# EAGLE design Shield (EAGLE 8.0.2)
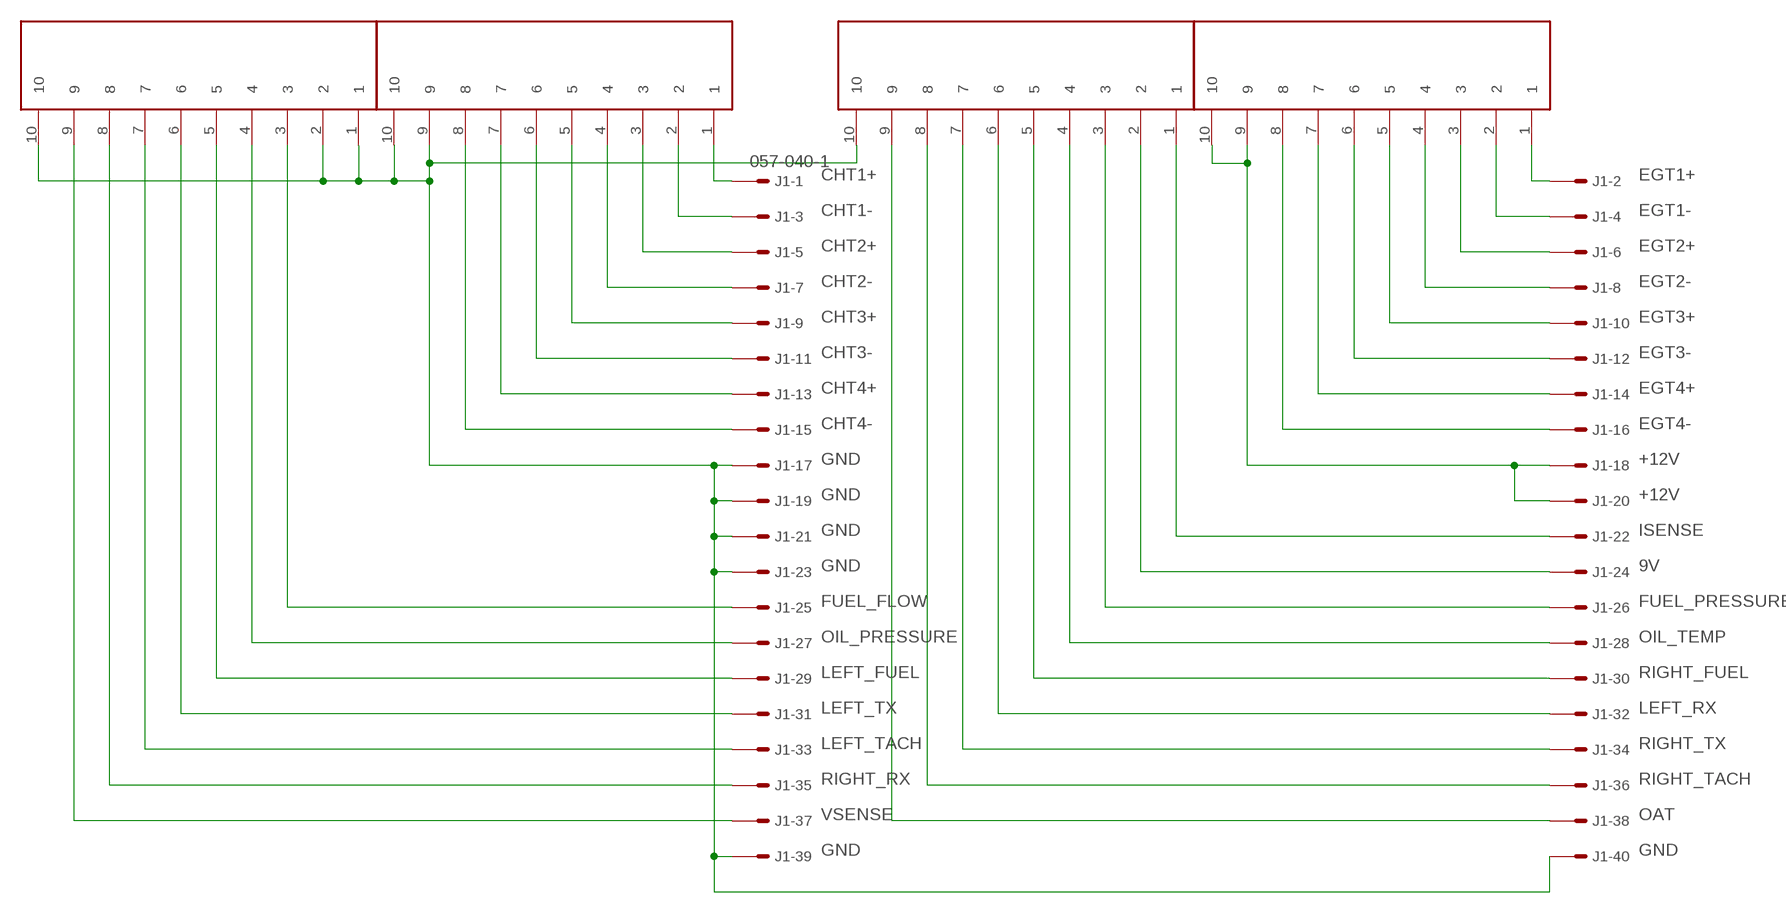
[diagram p0: schematic, sheet 1]

## Parts
J1  057-040-1  [057-040-1]
TB1  282847-10  [282847-10]
TB2  282847-10  [282847-10]
TB3  282847-10  [282847-10]
TB4  282847-10  [282847-10]

## Nets
9V: J1.24 TB3.2
+12V: J1.18 J1.20 TB4.9 TB4.10
CHT1+: J1.1 TB2.1
CHT1-: J1.3 TB2.2
CHT2+: J1.5 TB2.3
CHT2-: J1.7 TB2.4
CHT3+: J1.9 TB2.5
CHT3-: J1.11 TB2.6
CHT4+: J1.13 TB2.7
CHT4-: J1.15 TB2.8
EGT1+: J1.2 TB4.1
EGT1-: J1.4 TB4.2
EGT2+: J1.6 TB4.3
EGT2-: J1.8 TB4.4
EGT3+: J1.10 TB4.5
EGT3-: J1.12 TB4.6
EGT4+: J1.14 TB4.7
EGT4-: J1.16 TB4.8
FUEL_FLOW: J1.25 TB1.3
FUEL_PRESSURE: J1.26 TB3.3
GND: J1.17 J1.19 J1.21 J1.23 J1.39 J1.40 TB1.1 TB1.2 TB1.10 TB2.9 TB2.10 TB3.10
ISENSE: J1.22 TB3.1
LEFT_FUEL: J1.29 TB1.5
LEFT_RX: J1.32 TB3.6
LEFT_TACH: J1.33 TB1.7
LEFT_TX: J1.31 TB1.6
OAT: J1.38 TB3.9
OIL_PRESSURE: J1.27 TB1.4
OIL_TEMP: J1.28 TB3.4
RIGHT_FUEL: J1.30 TB3.5
RIGHT_RX: J1.35 TB1.8
RIGHT_TACH: J1.36 TB3.8
RIGHT_TX: J1.34 TB3.7
VSENSE: J1.37 TB1.9

## Library data of the parts
J1 = con-panduit-changed:057-040-: CONNECTOR 40-pin series 057 contact pc board low profile headers; OC_FARNELL: unknown; OC_NEWARK: unknown; PARTNO: SBH11-PBPC-D20-ST-BK
TB1-TB4 = TEConnectivity:282847-10; PARTNO: 1-282847-0

## Board
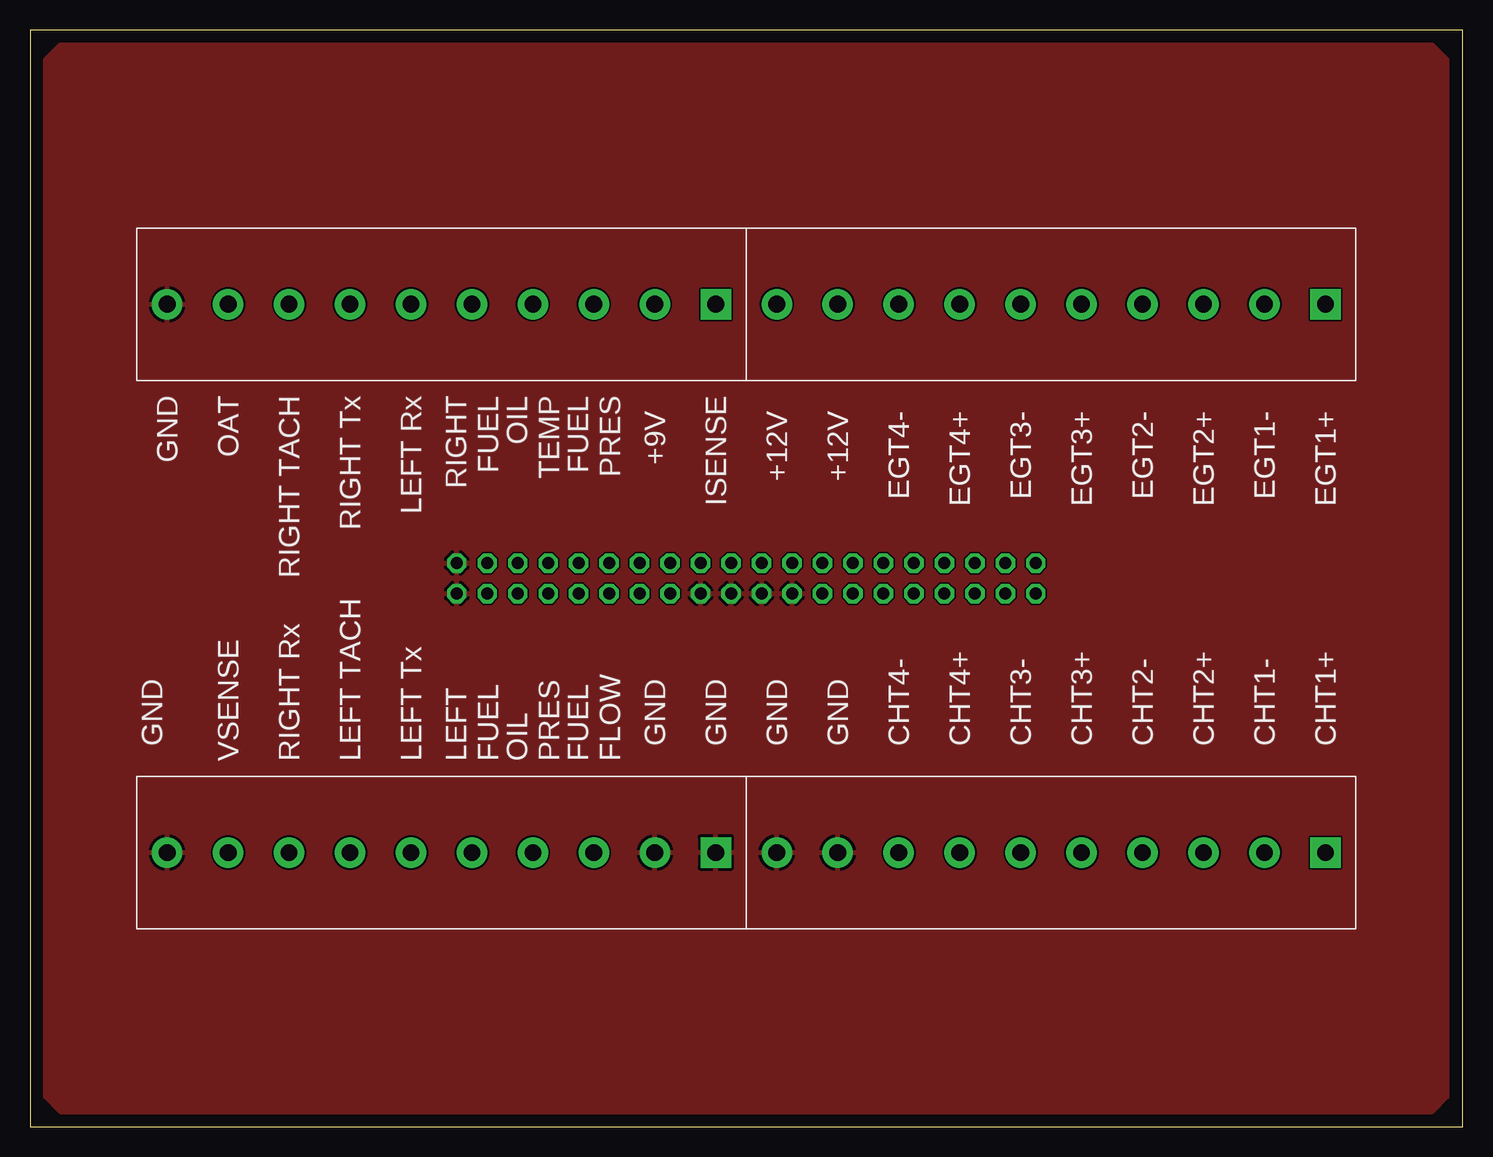
[diagram p1: board, top side]
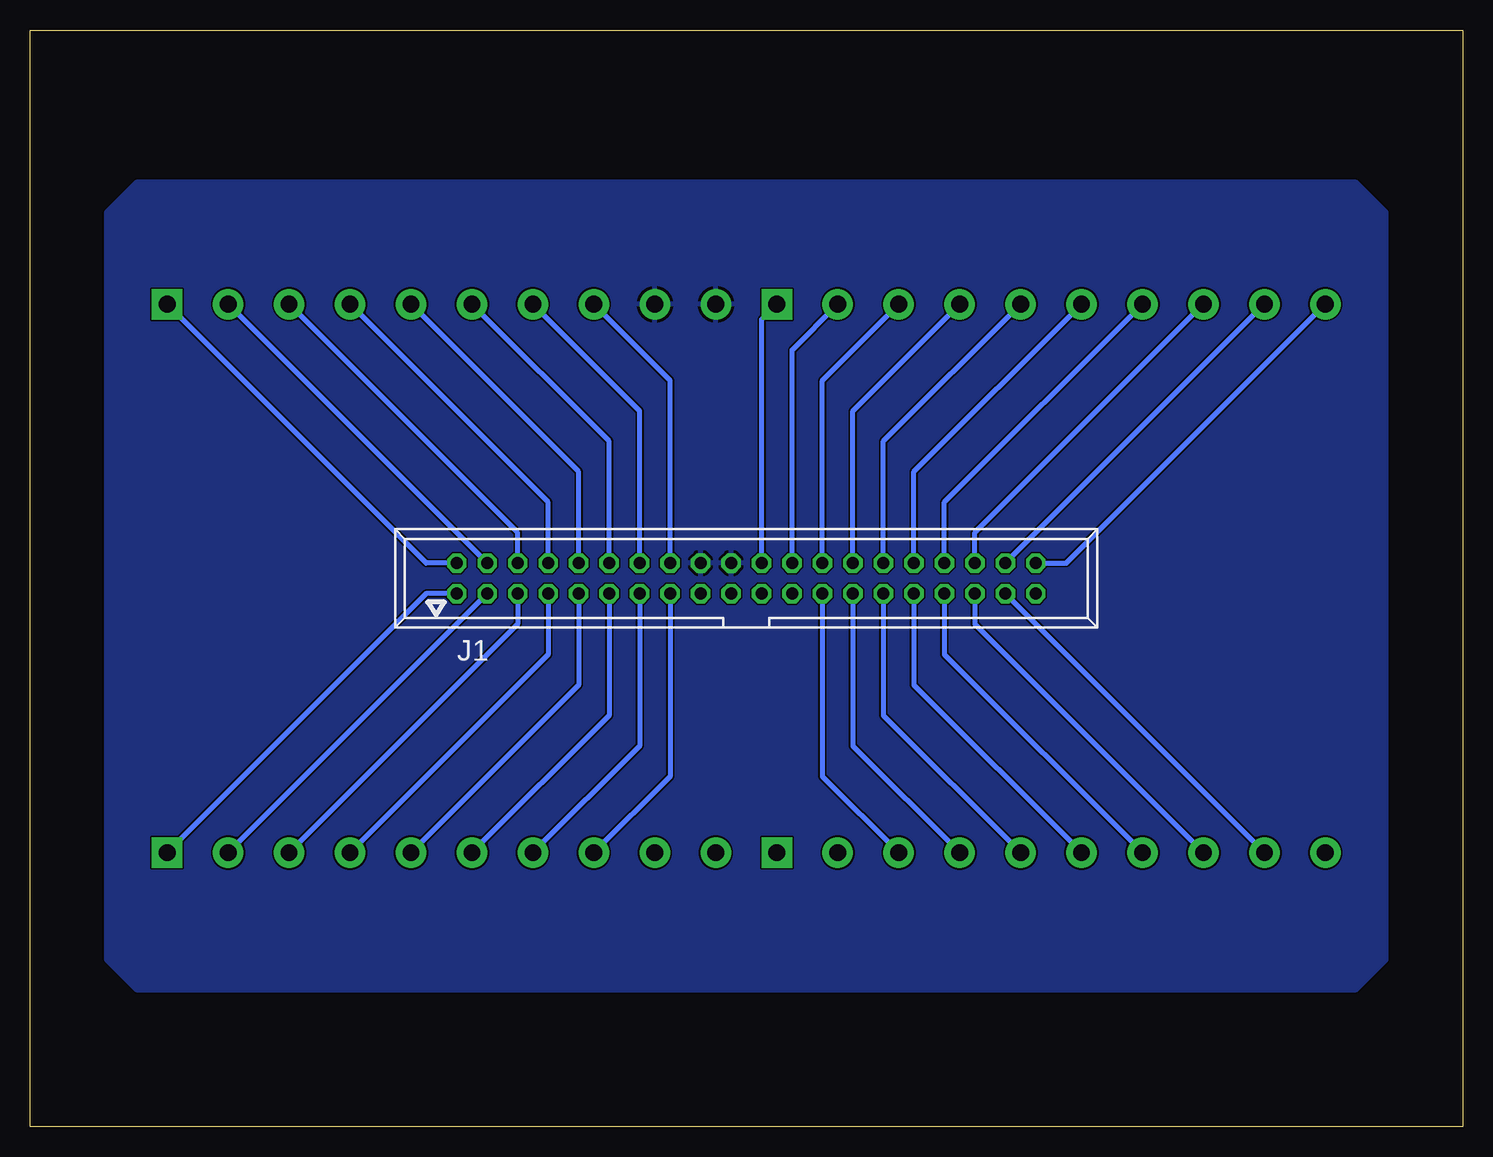
[diagram p2: board, bottom side, seen from below]

Size 119.38 x 91.44 mm. Coordinates in mm from the lower left corner, seen from the top.
Outline: 0,0 119.38,0 119.38,91.44 0,91.44 0,0
Copper layers (1*16): Top 0.035mm / dielectric 1.5mm / Bottom 0.035mm
Design rules "DFRobot_Eagle_Rule_v0.4": minimum track width 6mil, minimum drill 12mil, track to track 6mil, track to pad 6mil, pad to pad 6mil, via to via 6mil, smd to smd 0mil, copper to edge 10mil, drill to drill 10mil, minimum pad ring 12mil, minimum via ring 8mil, stop-mask expansion 2mil, vias tented up to drill 25mil, thermal gap 10mil

### Footprints (pad centres in the part's own frame; a part is rotated, then mirrored left to right if it is on the bottom)
057-040-1 = drill 1 octagon: 1 -24.13,-1.27; 2 -24.13,1.27; 3 -21.59,-1.27; 4 -21.59,1.27; 5 -19.05,-1.27; 6 -19.05,1.27; 7 -16.51,-1.27; 8 -16.51,1.27; 9 -13.97,-1.27; 10 -13.97,1.27; 11 -11.43,-1.27; 12 -11.43,1.27; 13 -8.89,-1.27; 14 -8.89,1.27; 15 -6.35,-1.27; 16 -6.35,1.27; 17 -3.81,-1.27; 18 -3.81,1.27; 19 -1.27,-1.27; 20 -1.27,1.27; 21 1.27,-1.27; 22 1.27,1.27; 23 3.81,-1.27; 24 3.81,1.27; 25 6.35,-1.27; 26 6.35,1.27; 27 8.89,-1.27; 28 8.89,1.27; 29 11.43,-1.27; 30 11.43,1.27; 31 13.97,-1.27; 32 13.97,1.27; 33 16.51,-1.27; 34 16.51,1.27; 35 19.05,-1.27; 36 19.05,1.27; 37 21.59,-1.27; 38 21.59,1.27; 39 24.13,-1.27; 40 24.13,1.27
282847-10 = drill 1.4 pad 2.54 square: 1 0,0 | drill 1.4 pad 2.54: 2 5.08,0; 3 10.16,0; 4 15.24,0; 5 20.32,0; 6 25.4,0; 7 30.48,0; 8 35.56,0; 9 40.64,0; 10 45.72,0

### Placement (x,y rotation side)
J1  59.69,45.72 0 bottom
TB1  57.15,22.86 180 top
TB2  107.95,22.86 180 top
TB3  57.15,68.58 180 top
TB4  107.95,68.58 180 top

### Tracks (layer width: path | path; a pad name or v marks a point on that pad's centre or on a via)
9V
  Bottom 0.406: J1.24 55.88,64.77 TB3.2
+12V
  pour Bottom: 6.35,76.2 8.89,78.74 110.49,78.74 113.03,76.2 113.03,13.97 110.49,11.43 8.89,11.43 6.35,13.97
CHT1+
  Bottom 0.406: J1.1 86.36,44.45 TB2.1
CHT1-
  Bottom 0.406: J1.3 TB2.2
CHT2+
  Bottom 0.406: J1.5 78.74,41.91 TB2.3
CHT2-
  Bottom 0.406: J1.7 76.2,39.37 TB2.4
CHT3+
  Bottom 0.406: J1.9 73.66,36.83 TB2.5
CHT3-
  Bottom 0.406: J1.11 71.12,34.29 TB2.6
CHT4+
  Bottom 0.406: J1.13 68.58,31.75 TB2.7
CHT4-
  Bottom 0.406: J1.15 66.04,29.21 TB2.8
EGT1+
  Bottom 0.406: J1.2 86.36,46.99 TB4.1
EGT1-
  Bottom 0.406: J1.4 TB4.2
EGT2+
  Bottom 0.406: J1.6 78.74,49.53 TB4.3
EGT2-
  Bottom 0.406: J1.8 76.2,52.07 TB4.4
EGT3+
  Bottom 0.406: J1.10 73.66,54.61 TB4.5
EGT3-
  Bottom 0.406: J1.12 71.12,57.15 TB4.6
EGT4+
  Bottom 0.406: J1.14 68.58,59.69 TB4.7
EGT4-
  Bottom 0.406: J1.16 66.04,62.23 TB4.8
FUEL_FLOW
  Bottom 0.406: J1.25 53.34,29.21 TB1.3
FUEL_PRESSURE
  Bottom 0.406: J1.26 53.34,62.23 TB3.3
GND
  Bottom 0.406: J1.40 33.02,46.99 TB3.10
  pour Top: 2.54,90.17 1.27,88.9 1.27,2.54 2.54,1.27 96.52,1.27 116.84,1.27 118.11,2.54 118.11,88.9 116.84,90.17 22.86,90.17
ISENSE
  Bottom 0.406: J1.22 58.42,67.31 TB3.1
LEFT_FUEL
  Bottom 0.406: J1.29 48.26,34.29 TB1.5
LEFT_RX
  Bottom 0.406: J1.32 45.72,54.61 TB3.6
LEFT_TACH
  Bottom 0.406: J1.33 43.18,39.37 TB1.7
LEFT_TX
  Bottom 0.406: J1.31 45.72,36.83 TB1.6
OAT
  Bottom 0.406: J1.38 TB3.9
OIL_PRESSURE
  Bottom 0.406: J1.27 50.8,31.75 TB1.4
OIL_TEMP
  Bottom 0.406: J1.28 50.8,59.69 TB3.4
RIGHT_FUEL
  Bottom 0.406: J1.30 48.26,57.15 TB3.5
RIGHT_RX
  Bottom 0.406: J1.35 40.64,41.91 TB1.8
RIGHT_TACH
  Bottom 0.406: J1.36 40.64,49.53 TB3.8
RIGHT_TX
  Bottom 0.406: J1.34 43.18,52.07 TB3.7
VSENSE
  Bottom 0.406: J1.37 TB1.9

### Text on the board
tNames: GND | OAT | RIGHT TACH | RIGHT Tx | LEFT Rx | RIGHT / FUEL | OIL / TEMP | FUEL / PRES | ISENSE | +9V | +12V | +12V | EGT4- | EGT4+ | EGT3- | EGT3+ | EGT2- | EGT2+ | EGT1- | EGT1+ | GND | GND | GND | GND | GND | CHT4- | CHT4+ | CHT3- | CHT3+ | CHT2- | CHT2+ | CHT1- | CHT1+ | VSENSE | RIGHT Rx | LEFT TACH | LEFT Tx | LEFT / FUEL | OIL / PRES | FUEL / FLOW